# Altium schematic sheet Power_Input.SchDoc: Power Input PCB
size A4; Organization: Altium Limited; Address1: L3, 12a Rodborough Rd; Address2: Frenchs Forest; Address3: NSW; Address4: Australia 2086
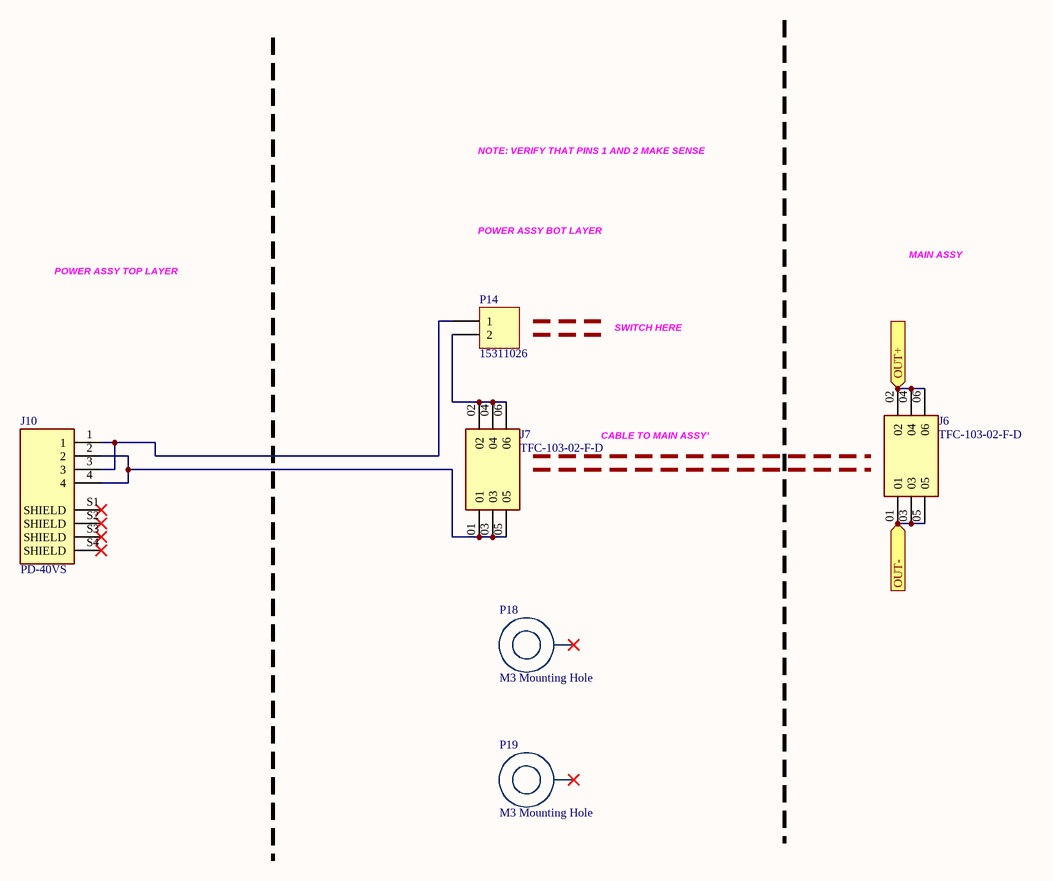
[diagram p0: Power_Input.SchDoc]

## Parts
J6  TFC-103-02-F-D  [SAMTEC_TFC-103-02-F-D]
J7  TFC-103-02-F-D  [SAMTEC_TFC-103-02-F-D]
J10  PD-40VS  [CUI_PD-40VS]
P14  15311026  [HDR1X2]
P18  M3 Mounting Hole  [MH-M3]
P19  M3 Mounting Hole  [MH-M3]

## Ports
OUT+ (in), OUT- (in)

## Nets
OUT+: J6.02 J6.04 J6.06 ; port OUT+
OUT-: J6.01 J6.03 J6.05 ; port OUT-
NetJ7_01: J7.01 J7.03 J7.05 J10.2 J10.4
NetJ7_02: J7.02 J7.04 J7.06 P14.2
NetJ10_1: J10.1 J10.3 P14.1

Not connected (* = marked no-connect by the designer): J10 S1(SHIELD)* S2(SHIELD)* S3(SHIELD)* S4(SHIELD)*; P18 1*; P19 1*

## Notes on the sheet
- NOTE: VERIFY THAT PINS 1 AND 2 MAKE SENSE
- POWER ASSY BOT LAYER
- MAIN ASSY
- POWER ASSY TOP LAYER
- SWITCH HERE
- CABLE TO MAIN ASSY'
- Title
- Date:
- RE:
- Arturo di Girolamo
- Size:
- A3
- A

## Library data of the parts
J6 J7 = TFC-103-02-F-D: MF: Samtec; Value: *; Availability: Unavailable; MP: TFC-103-02-F-D; Price: None; Package: None; ASYPN: TFC-103-02-F-D
J10 = PD-40VS: 4 Position , 7.5 A, Vertical, Through Hole, Shielded, Power DIN Connector; MF: {'manufacturer': u'CUI'}; MP: PD-40VS; Package: None; Price: None; Availability: Unavailable; Value: *
P14 = Header 2: Header, 2-Pin; LatestRevisionDate: 17-Jul-2002; LatestRevisionNote: Re-released for DXP Platform.; Publisher: Altium Limited
P18 P19 = MH-M3